# EAGLE schematic K-Diag small- double (EAGLE 6.5.0)
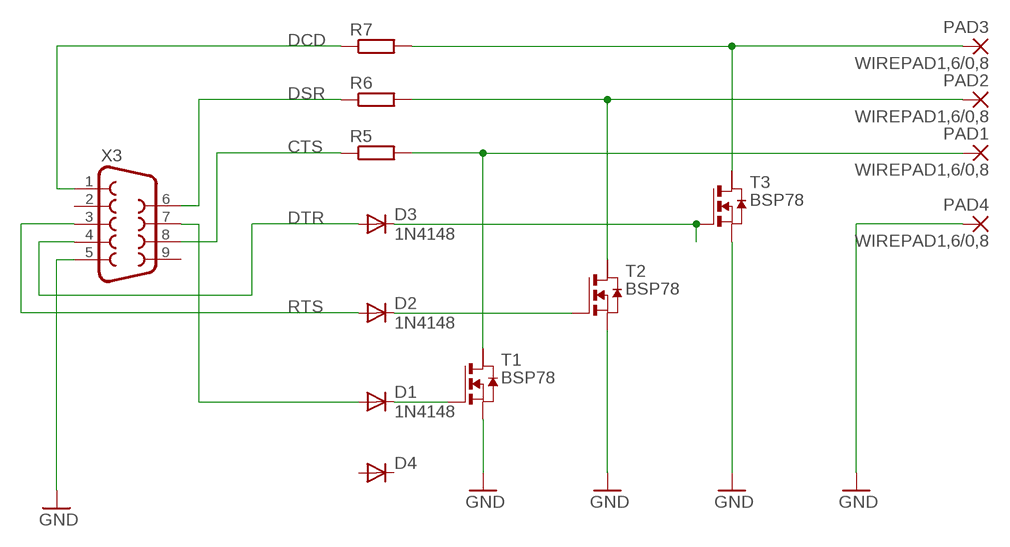
[diagram p0: schematic, sheet 1]

## Parts
D1  1N4148  DIODE-SOD323-W  [SOD323-W]
D2  1N4148  DIODE-SOD323-W  [SOD323-W]
D3  1N4148  DIODE-SOD323-W  [SOD323-W]
D4  DIODE-SOD323-W  [SOD323-W]
PAD1  WIREPAD1,6/0,8  [1,6/0,8]
PAD2  WIREPAD1,6/0,8  [1,6/0,8]
PAD3  WIREPAD1,6/0,8  [1,6/0,8]
PAD4  WIREPAD1,6/0,8  [1,6/0,8]
R5  R-EU_R0805  [R0805]
R6  R-EU_R0805  [R0805]
R7  R-EU_R0805  [R0805]
T1  BSP78  NMOSSOT223  [SOT223]
T2  BSP78  NMOSSOT223  [SOT223]
T3  BSP78  NMOSSOT223  [SOT223]
X3  F09D  [F09D]

## Nets
CTS: R5.1 X3.8
DCD: R7.1 X3.1
DSR: R6.1 X3.6
DTR: D3.A X3.4
GND: PAD4.1(P) T1.3(S) T2.3(S) T3.3(S) X3.5
N$1: D3.C T3.1(G)
N$2: D2.C T2.1(G)
N$3: D1.C T1.1(G)
N$4: PAD1.1(P) R5.2 T1.2(D)
N$5: PAD2.1(P) R6.2 T2.2(D)
N$6: PAD3.1(P) R7.2 T3.2(D)
N$7: D1.A X3.7
RTS: D2.A X3.3
Unconnected: D4.A D4.C T1.4(D2) T2.4(D2) T3.4(D2) X3.2 X3.9

## Library data of the parts
D1-D4 = diode:DIODE-: DIODE
PAD1-PAD4 = wirepad:WIREPAD: Wire PAD connect wire on PCB
R5-R7 = rcl:R-EU_: RESISTOR, European symbol
T1-T3 = zetex:NMOSSOT223: MOS FET
X3 = con-subd:F09: SUB-D; OC_FARNELL: unknown; OC_NEWARK: unknown